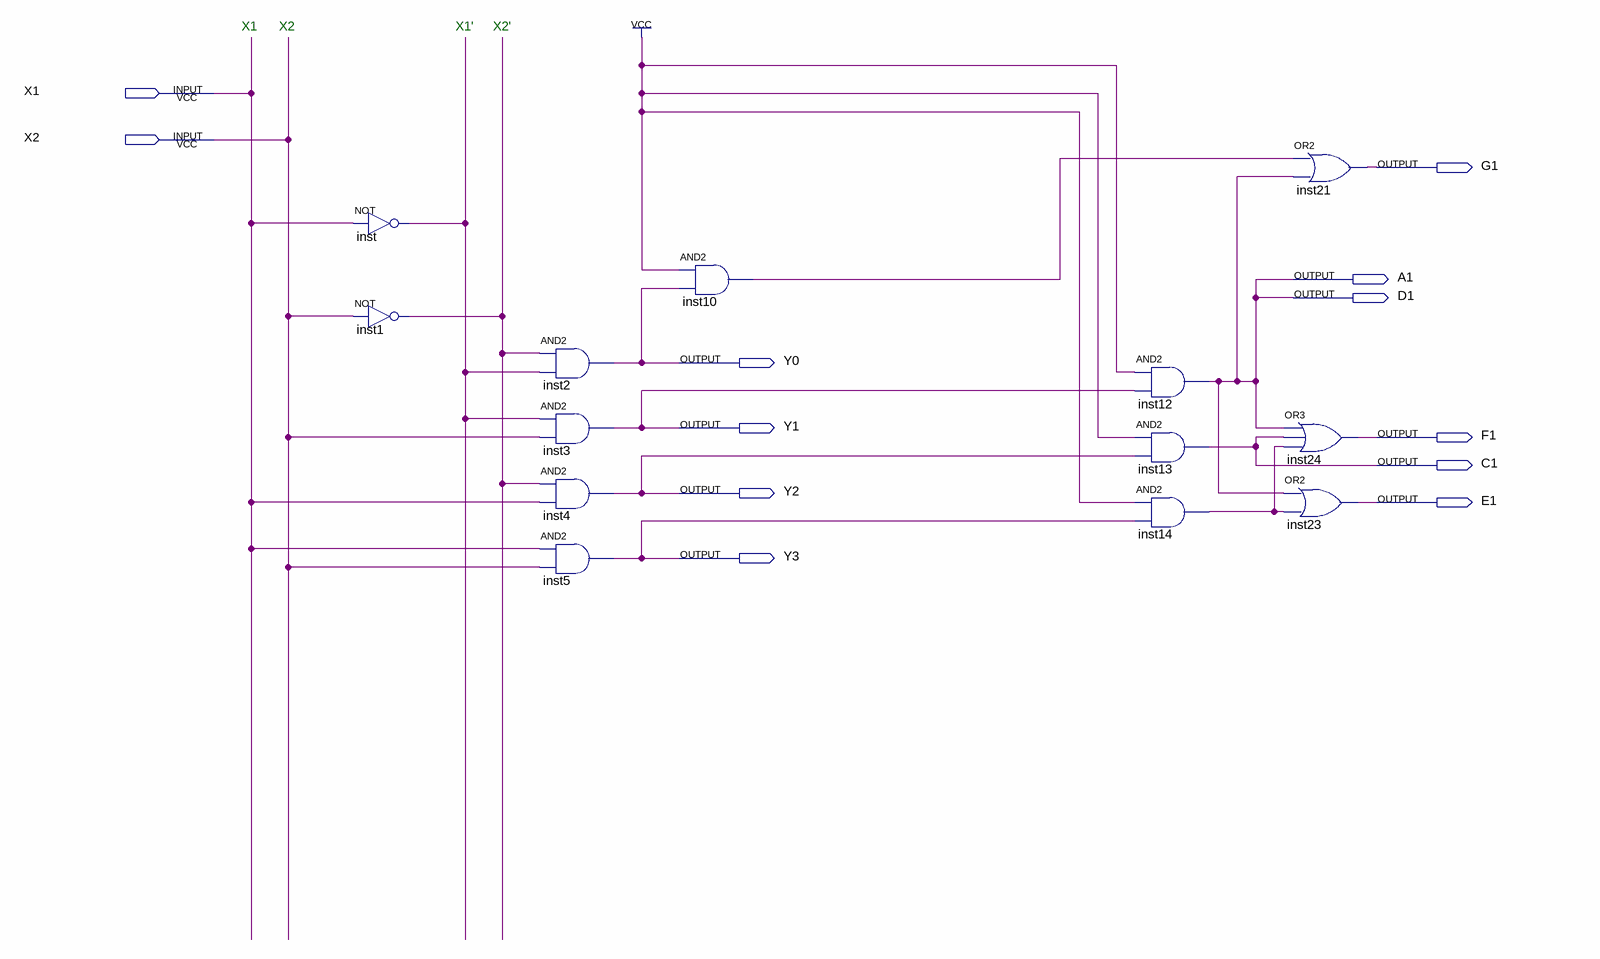
[diagram p0: schematic sheet]
// Quartus schematic cmb1.bdf as structural Verilog: 13 symbols, 12 pins
module cmb1 (
  input  X1,
  input  X2,
  output G1,
  output A1,
  output D1,
  output Y0,
  output Y1,
  output F1,
  output C1,
  output Y2,
  output E1,
  output Y3
);

  wire inst1_out, inst10_out, inst14_out, inst_out;

  not inst (inst_out, X1);
  not inst1 (inst1_out, X2);
  and inst2 (Y0, inst1_out, inst_out);
  and inst3 (Y1, inst_out, X2);
  and inst4 (Y2, inst1_out, X1);
  and inst5 (Y3, X1, X2);
  and inst10 (inst10_out, 1'b1, Y0);
  and inst12 (A1, 1'b1, Y1);
  and inst13 (C1, 1'b1, Y2);
  and inst14 (inst14_out, 1'b1, Y3);
  or inst21 (G1, inst10_out, A1);
  or inst24 (F1, A1, C1, inst14_out);
  or inst23 (E1, A1, inst14_out);

  assign D1 = A1;

  // Notes on the sheet:
  //   X1
  //   X2
  //   X1'
  //   X2'
endmodule
